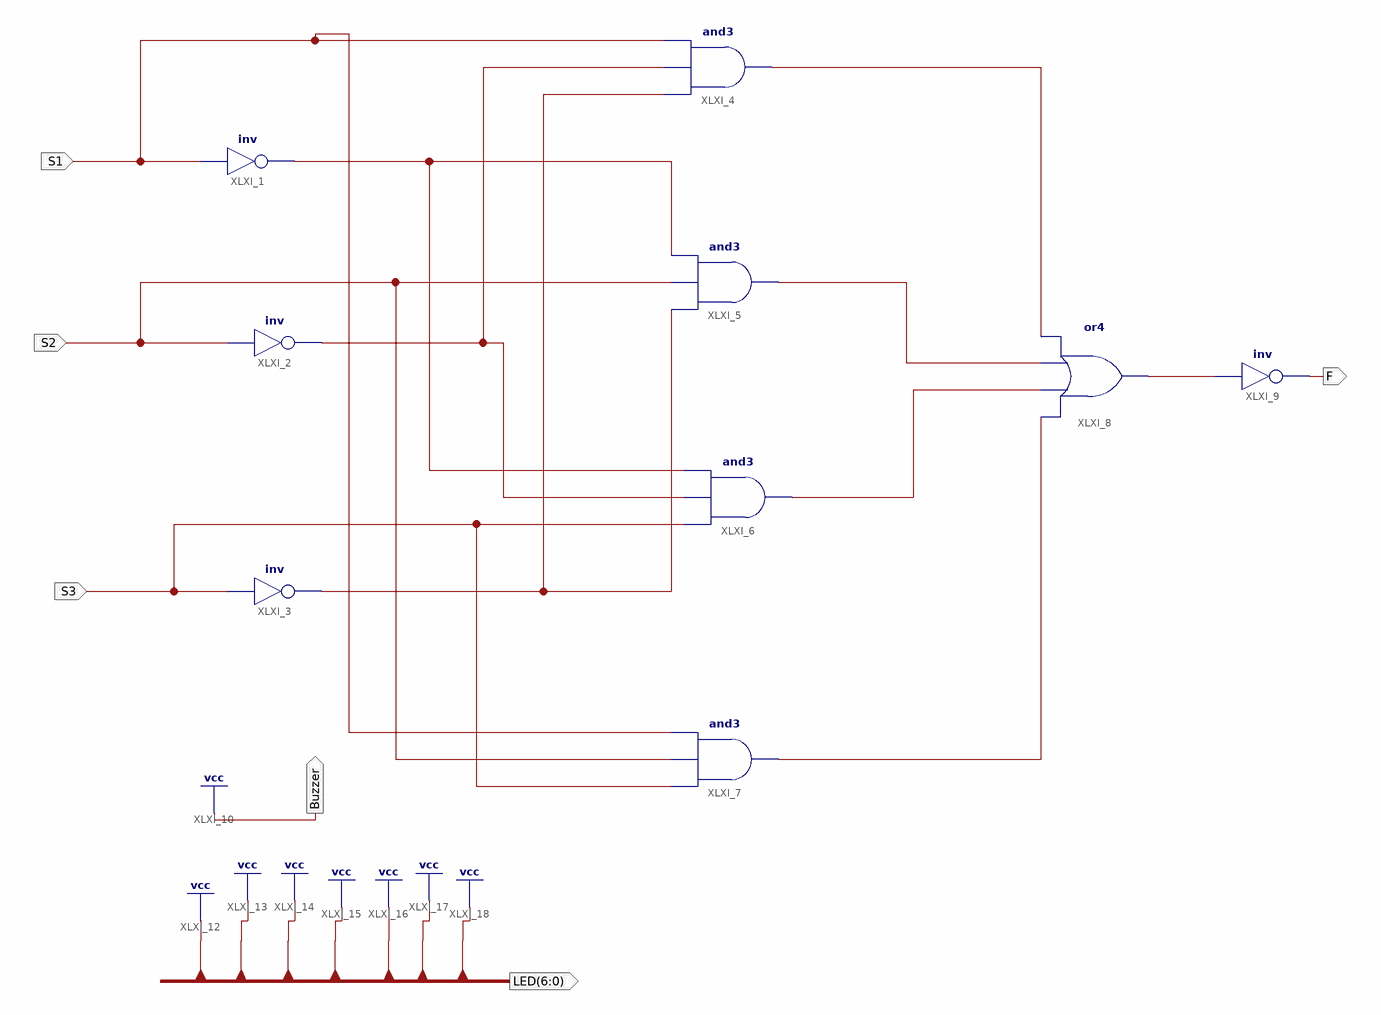
[diagram p0: schematic sheet 1]
// Xilinx ISE schematic LampCtrl.sch (kintex7) as structural Verilog: 9 symbols, 6 ports
module LampCtrl (
  input  S1,
  input  S2,
  input  S3,
  output F,
  output Buzzer,
  output [6:0] LED
);

  wire XLXN_3, XLXN_7, XLXN_12, XLXN_15, XLXN_16, XLXN_17, XLXN_18, XLXN_20;

  not XLXI_1 (XLXN_3, S1);
  not XLXI_2 (XLXN_7, S2);
  not XLXI_3 (XLXN_12, S3);
  and XLXI_4 (XLXN_15, XLXN_12, XLXN_7, S1);
  and XLXI_5 (XLXN_16, XLXN_12, S2, XLXN_3);
  and XLXI_6 (XLXN_17, S3, XLXN_7, XLXN_3);
  and XLXI_7 (XLXN_18, S3, S2, S1);
  or XLXI_8 (XLXN_20, XLXN_18, XLXN_17, XLXN_16, XLXN_15);
  not XLXI_9 (F, XLXN_20);

  assign Buzzer = 1'b1;
  assign LED = {7{1'b1}};
endmodule
